# EAGLE design 3340 (EAGLE 7.2.0)
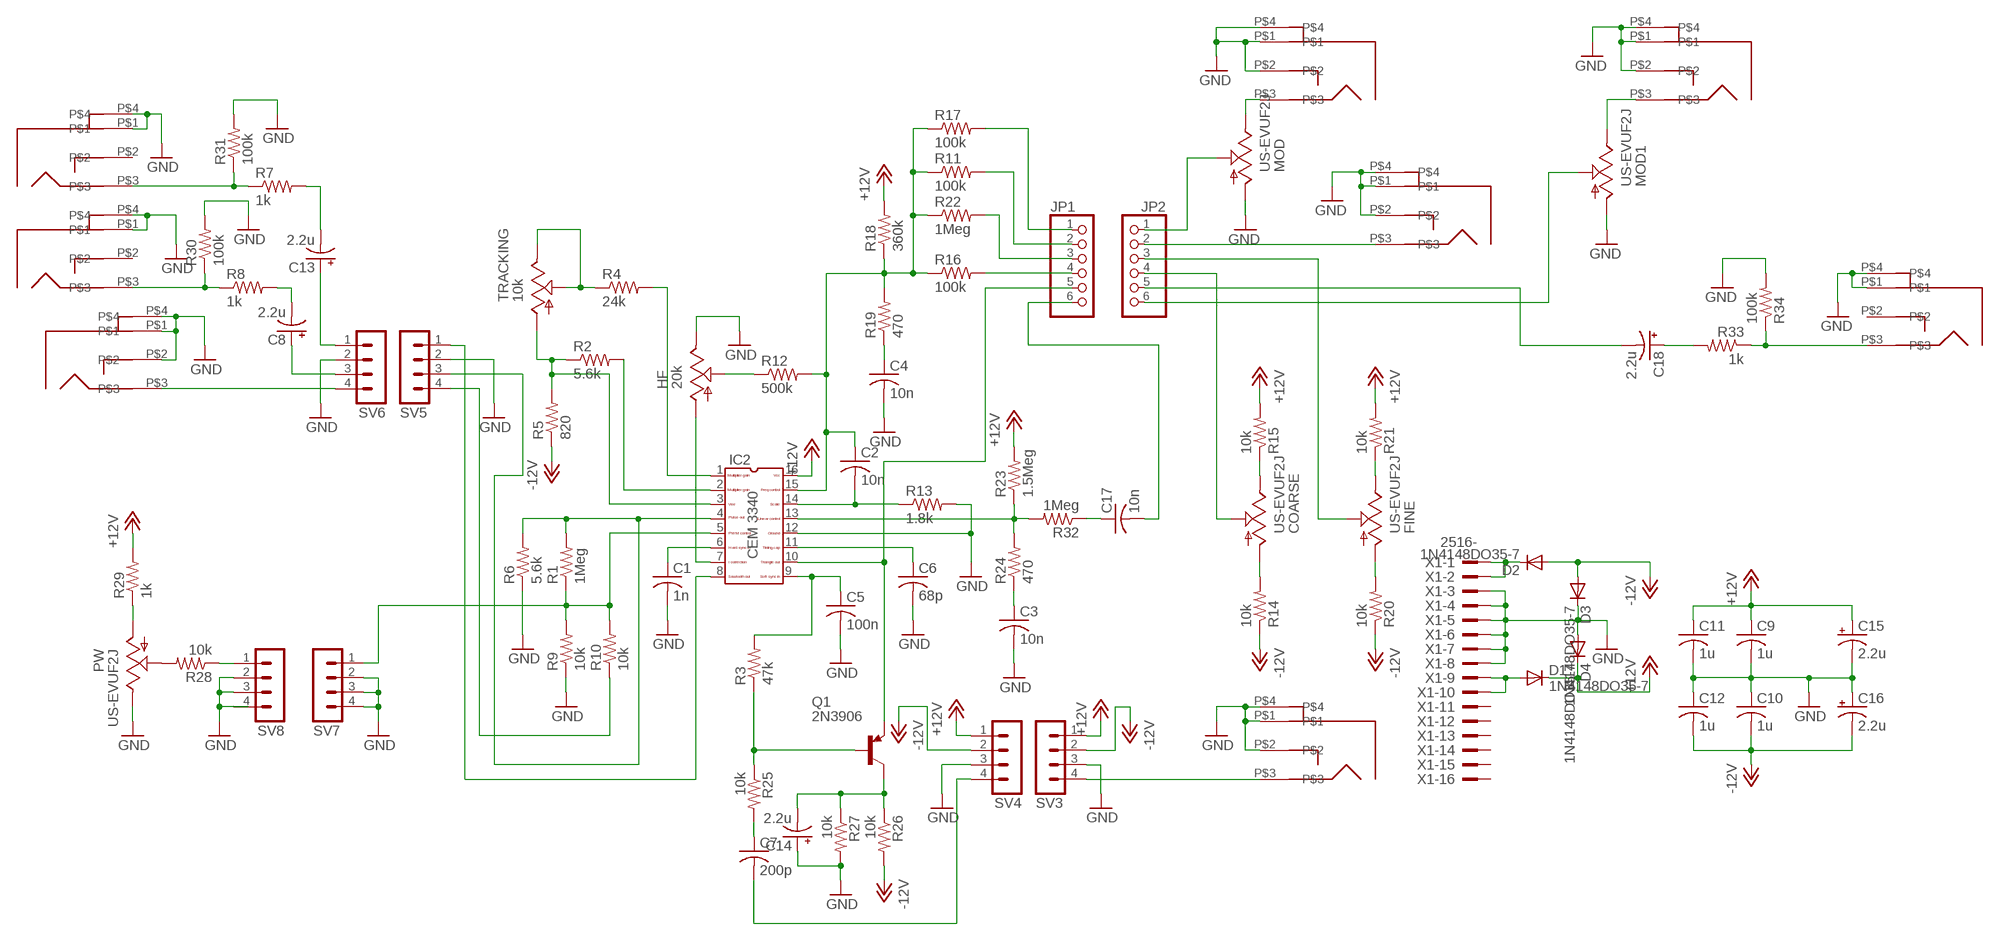
[diagram p0: schematic, sheet 1]

## Parts
C1  1n  C-US050-025X075  [C050-025X075]
C2  10n  C-US050-025X075  [C050-025X075]
C3  10n  C-US050-025X075  [C050-025X075]
C4  10n  C-US050-025X075  [C050-025X075]
C5  100n  C-US050-025X075  [C050-025X075]
C6  68p  C-US050-025X075  [C050-025X075]
C7  200p  C-US050-025X075  [C050-025X075]
C8  2.2u  CPOL-USE2.5-6  [E2,5-6]
C9  1u  C-US050-025X075  [C050-025X075]
C10  1u  C-US050-025X075  [C050-025X075]
C11  1u  C-US050-025X075  [C050-025X075]
C12  1u  C-US050-025X075  [C050-025X075]
C13  2.2u  CPOL-USE2.5-6  [E2,5-6]
C14  2.2u  CPOL-USE2.5-6  [E2,5-6]
C15  2.2u  CPOL-USE2.5-6  [E2,5-6]
C16  2.2u  CPOL-USE2.5-6  [E2,5-6]
C17  10n  C-US050-025X075  [C050-025X075]
C18  2.2u  CPOL-USE2.5-6  [E2,5-6]
COARSE  US-EVUF2J  [EVUFXJ]
CVIN1  PJ301BM  [PJ301BM]
CVIN2  PJ301BM  [PJ301BM]
D1  1N4148DO35-7  [DO35-7]
D2  1N4148DO35-7  [DO35-7]
D3  1N4148DO35-7  [DO35-7]
D4  1N4148DO35-7  [DO35-7]
EXPMOD  PJ301BM  [PJ301BM]
FINE  US-EVUF2J  [EVUFXJ]
HF  20k  TRIM_US-S64W  [S64W]
IC2  CEM3340  [DIL16]
JP1  PINHD-1X6  [1X06]
JP2  PINHD-1X6  [1X06]
MOD  US-EVUF2J  [EVUFXJ]
MOD1  US-EVUF2J  [EVUFXJ]
PULSE  PJ301BM  [PJ301BM]
PW  US-EVUF2J  [EVUFXJ]
PWM  PJ301BM  [PJ301BM]
Q1  2N3906  [TO92]
R1  1Meg  R-US_0207/2V  [0207/2V]
R2  5.6k  R-US_0207/2V  [0207/2V]
R3  47k  R-US_0207/2V  [0207/2V]
R4  24k  R-US_0207/2V  [0207/2V]
R5  820  R-US_0207/2V  [0207/2V]
R6  5.6k  R-US_0207/2V  [0207/2V]
R7  1k  R-US_0207/7  [0207/7]
R8  1k  R-US_0207/7  [0207/7]
R9  10k  R-US_0207/2V  [0207/2V]
R10  10k  R-US_0207/2V  [0207/2V]
R11  100k  R-US_0207/2V  [0207/2V]
R12  500k  R-US_0207/2V  [0207/2V]
R13  1.8k  R-US_0207/2V  [0207/2V]
R14  10k  R-US_0207/7  [0207/7]
R15  10k  R-US_0207/7  [0207/7]
R16  100k  R-US_0207/2V  [0207/2V]
R17  100k  R-US_0207/2V  [0207/2V]
R18  360k  R-US_0207/2V  [0207/2V]
R19  470  R-US_0207/2V  [0207/2V]
R20  10k  R-US_0207/7  [0207/7]
R21  10k  R-US_0207/7  [0207/7]
R22  1Meg  R-US_0207/2V  [0207/2V]
R23  1.5Meg  R-US_0207/2V  [0207/2V]
R24  470  R-US_0207/2V  [0207/2V]
R25  10k  R-US_0207/2V  [0207/2V]
R26  10k  R-US_0207/2V  [0207/2V]
R27  10k  R-US_0207/2V  [0207/2V]
R28  10k  R-US_0207/7  [0207/7]
R29  1k  R-US_0207/7  [0207/7]
R30  100k  R-US_0207/7  [0207/7]
R31  100k  R-US_0207/7  [0207/7]
R32  1Meg  R-US_0207/2V  [0207/2V]
R33  1k  R-US_0207/7  [0207/7]
R34  100k  R-US_0207/7  [0207/7]
SAW  PJ301BM  [PJ301BM]
SAW1  PJ301BM  [PJ301BM]
SV3  MA04-1  [MA04-1]
SV4  MA04-1  [MA04-1]
SV5  MA04-1  [MA04-1]
SV6  MA04-1  [MA04-1]
SV7  MA04-1  [MA04-1]
SV8  MA04-1  [MA04-1]
SYNC  PJ301BM  [PJ301BM]
TRACKING  10k  TRIM_US-S64W  [S64W]
X1  2516-  [PAK100/2500-16]

## Nets
+12V: C9.1 C11.1 C15.+ D1.C D4.C IC2.16 R15.2 R18.2 R21.2 R23.2 R29.2 SV3.1 SV4.1
-12V: C10.2 C12.2 C16.- D2.A D3.A R5.1 R14.1 R20.1 R26.2 SV3.2 SV4.2
GND: C1.2 C3.2 C4.2 C5.2 C6.2 C9.2 C10.1 C11.2 C12.1 C14.+ C15.- C16.+ CVIN1.P$1 CVIN1.P$2 CVIN1.P$4 CVIN2.P$1 CVIN2.P$2 CVIN2.P$4 D3.C D4.A EXPMOD.P$1 EXPMOD.P$2 EXPMOD.P$4 HF.E IC2.12 MOD1.1(A) MOD.1(A) PULSE.P$1 PULSE.P$4 PW.3(E) PWM.P$1 PWM.P$2 PWM.P$4 R6.1 R9.1 R13.2 R27.2 R30.2 R31.2 R34.2 SAW1.P$1 SAW1.P$4 SAW.P$1 SAW.P$4 SV3.3 SV4.3 SV5.2 SV6.2 SV7.2 SV7.3 SV7.4 SV8.2 SV8.3 SYNC.P$1 SYNC.P$2 SYNC.P$4 X1.3 X1.4 X1.5 X1.6 X1.7 X1.8
N$1: IC2.1 R4.2
N$2: IC2.2 R2.2
N$3: R4.1 TRACKING.E TRACKING.S
N$4: IC2.5 R1.1 R9.2 R10.2 SV7.1
N$5: COARSE.2(S) JP2.4
N$6: COARSE.1(A) R14.2
N$7: COARSE.3(E) R15.1
N$8: IC2.4 R1.2 R6.2 SV5.3
N$9: R10.1 SV5.4
N$10: PWM.P$3 SV6.4
N$11: C1.1 IC2.6
N$12: IC2.8 SV5.1
N$13: C13.- R7.2
N$14: R7.1 R31.1 SAW.P$3
N$15: PULSE.P$3 R8.1 R30.1
N$16: HF.A IC2.7
N$17: JP1.4 R16.2
N$18: HF.S R12.1
N$19: C2.1 IC2.15 R11.1 R12.2 R16.1 R17.1 R18.1 R19.2 R22.1
N$20: C5.1 IC2.9 R3.2
N$21: JP1.1 R17.2
N$22: EXPMOD.P$3 MOD.3(E)
N$23: C6.1 IC2.11
N$24: C17.1 R32.1
N$25: JP1.2 R11.2
N$26: C13.+ SV6.1
N$27: C8.+ SV6.3
N$28: PW.2(S) R28.2
N$29: C2.2 IC2.14 R13.1
N$30: SV3.4 SYNC.P$3
N$31: JP2.1 MOD.2(S)
N$32: IC2.10 JP1.5 Q1.3(E)
N$33: FINE.1(A) R20.2
N$34: C4.1 R19.1
N$35: CVIN1.P$3 JP2.2
N$36: FINE.3(E) R21.1
N$37: FINE.2(S) JP2.3
N$38: IC2.13 R23.1 R24.2 R32.2
N$39: JP1.3 R22.2
N$40: C3.1 R24.1
N$41: Q1.2(B) R3.1 R25.1
N$42: C7.1 R25.2
N$43: D2.C X1.1 X1.2
N$44: C7.2 SV4.4
N$45: D1.A X1.9 X1.10
N$46: C14.- Q1.1(C) R26.1 R27.1
N$47: PW.1(A) R29.1
N$48: R28.1 SV8.1
N$49: C8.- R8.2
N$50: IC2.3 R2.1 R5.2 TRACKING.A
N$51: C17.2 JP1.6
N$52: JP2.6 MOD1.2(S)
N$53: C18.+ R33.2
N$54: R33.1 R34.1 SAW1.P$3
N$55: C18.- JP2.5
N$56: CVIN2.P$3 MOD1.3(E)
Unconnected: PULSE.P$2 SAW1.P$2 SAW.P$2 SV8.4 X1.11 X1.12 X1.13 X1.14 X1.15 X1.16

## Library data of the parts
C1-C7 C9-C12 C17 = dan:C-US: CAPACITOR, American symbol
C8 C13-C16 C18 = dan:CPOL-US: POLARIZED CAPACITOR, American symbol
COARSE FINE MOD MOD1 PW = dan:US-EVU: 9 mm Square Rotary Potentiometers Source: Panasonic
CVIN1 CVIN2 EXPMOD PULSE PWM SAW SAW1 SYNC = dan:PJ301BM
D1-D4 = dan:1N4148: DIODE high speed (Philips)
HF TRACKING = dan:TRIM_US-: POTENTIOMETER
IC2 = CEM:CEM3340: CEM 3340 VCO
JP1 JP2 = dan:PINHD-1X6: PIN HEADER
Q1 = dan:2N3906: PNP Transistor
R1-R34 = dan:R-US_: RESISTOR, American symbol
SV3-SV8 = dan:MA04-1: PIN HEADER; OC_FARNELL: unknown; OC_NEWARK: unknown
X1 = dan:2516-: 3M (TM) Pak 100 4-Wall Header Source: 3M; OC_FARNELL: unknown; OC_NEWARK: unknown

## Board
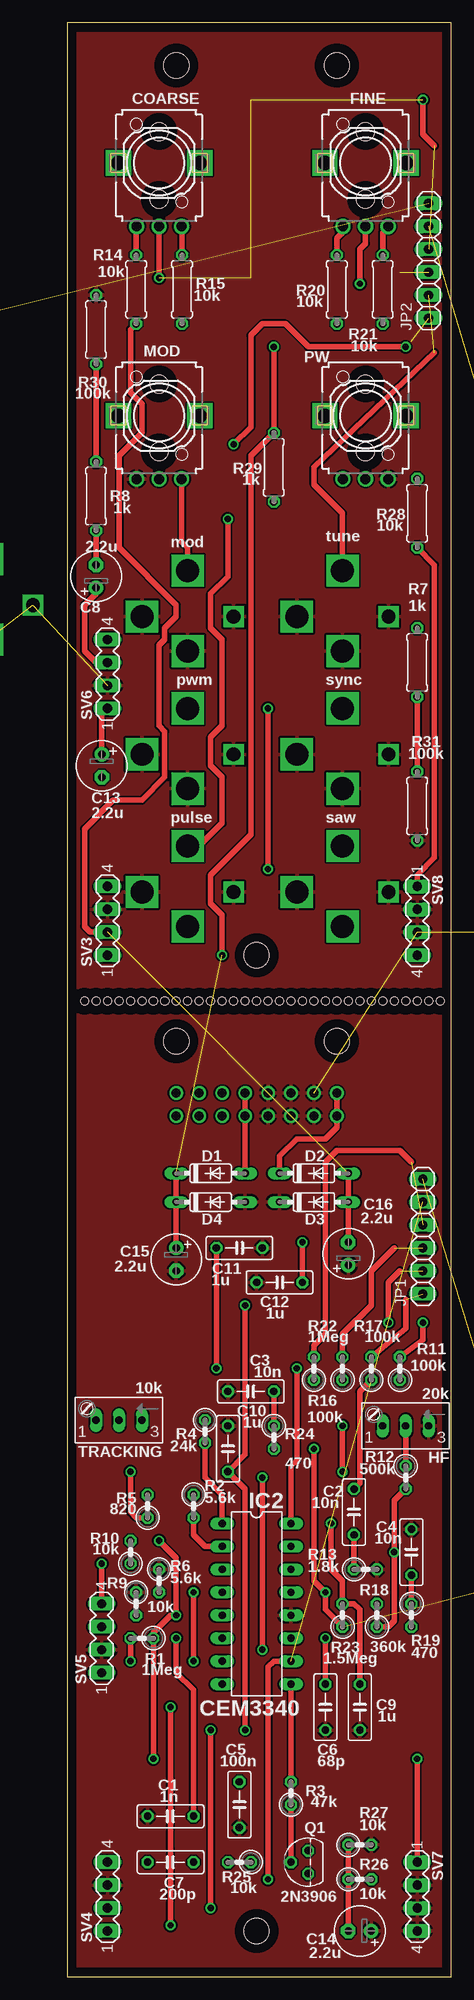
[diagram p1: board, top side]
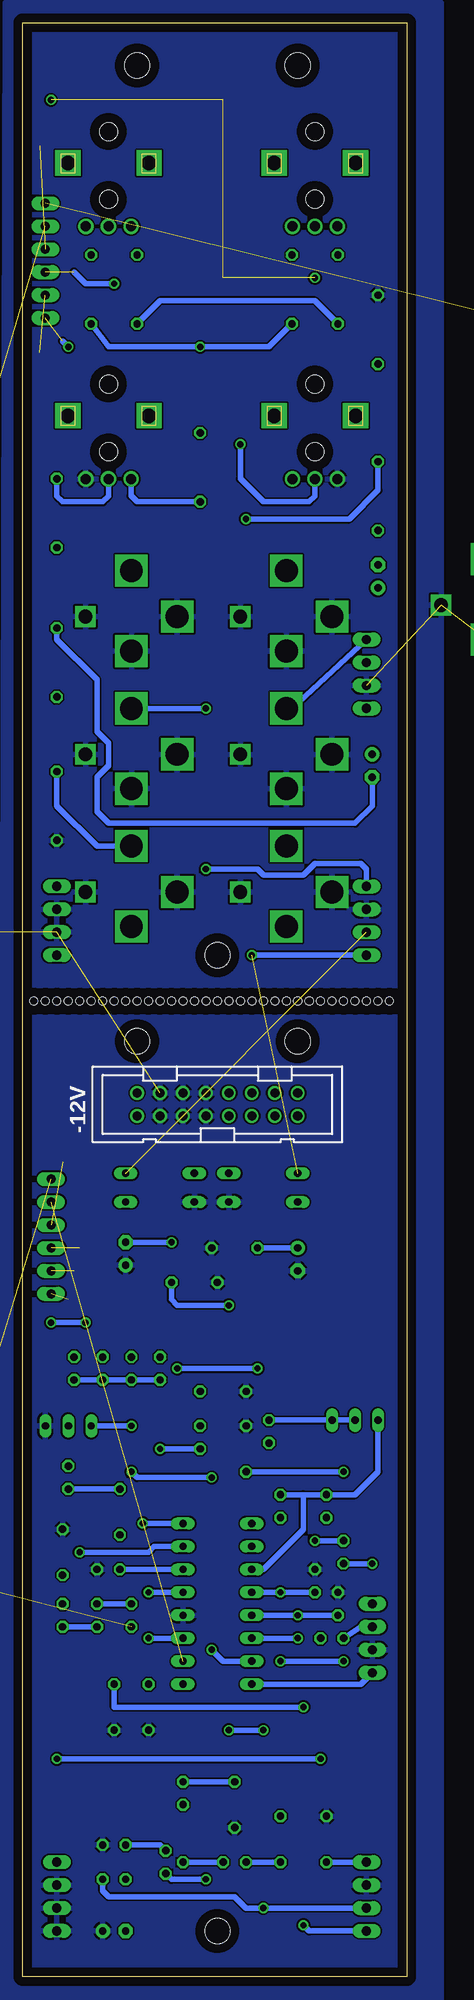
[diagram p2: board, bottom side, seen from below]

Size 42.52 x 216.21 mm. Coordinates in mm from the lower left corner, seen from the top.
Outline: 0,0 42.52,0 42.52,216.21 0,216.21 0,0
Copper layers (1*16): Top 0.035mm / dielectric 1.5mm / Bottom 0.035mm
Design rules "default": minimum track width 10mil, minimum drill 24mil, track to track 8mil, track to pad 8mil, pad to pad 8mil, via to via 8mil, smd to smd 8mil, copper to edge 40mil, drill to drill 8mil, minimum pad ring 10mil, minimum via ring 8mil, stop-mask expansion 4mil, vias tented up to drill 0mil, thermal gap 10mil
Holes 0.9 mm at 10.79,107.95 9.53,107.95 8.26,107.95 6.99,107.95 5.71,107.95 4.45,107.95 3.17,107.95 1.91,107.95 12.06,107.95 13.34,107.95 14.61,107.95 15.88,107.95 26.04,107.95 24.77,107.95 23.5,107.95 22.23,107.95 20.95,107.95 19.68,107.95 18.41,107.95 17.14,107.95 27.3,107.95 28.57,107.95 29.84,107.95 31.11,107.95 41.27,107.95 40.01,107.95 38.73,107.95 37.47,107.95 36.2,107.95 34.92,107.95 33.66,107.95 32.38,107.95
Holes 2.8 mm at 12.06,211.46 29.84,211.46 12.06,103.5 29.84,103.5 20.95,5.08 20.95,113.03

### Footprints (pad centres in the part's own frame; a part is rotated, then mirrored left to right if it is on the bottom)
C050-025X075 = drill 0.813 octagon: 1 -2.54,0; 2 2.54,0
E2,5-6 = drill 0.813 pad 1.6: + -1.27,0 | drill 0.813 pad 1.6 octagon: - 1.27,0
EVUFXJ = drill 1.1 pad 1.676: 1 -2.5,-7; 2 0,-7; 3 2.5,-7 | drill 1.6 pad 2.8 square: M1 4.5,0; M2 -4.5,0 | hole 2: 0,3.5; 0,-4
PJ301BM = drill 1.524 square: P$1 5.08,0 | drill 2.54 square: P$2 0,-3.81; P$3 0,5.08; P$4 -5.08,0
DO35-7 = drill 0.813 long: A 3.81,0; C -3.81,0
S64W = drill 0.813 long: A 2.54,1.27; E -2.54,1.27; S 0,1.27
DIL16 = drill 0.813 long: 1 -8.89,-3.81; 2 -6.35,-3.81; 3 -3.81,-3.81; 4 -1.27,-3.81; 5 1.27,-3.81; 6 3.81,-3.81; 7 6.35,-3.81; 8 8.89,-3.81; 9 8.89,3.81; 10 6.35,3.81; 11 3.81,3.81; 12 1.27,3.81; 13 -1.27,3.81; 14 -3.81,3.81; 15 -6.35,3.81; 16 -8.89,3.81
1X06 = drill 1.016 long: 1 -6.35,0; 2 -3.81,0; 3 -1.27,0; 4 1.27,0; 5 3.81,0; 6 6.35,0
TO92 = drill 0.813 octagon: 1 1.27,0; 2 0,1.905; 3 -1.27,0
0207/2V = drill 0.813 octagon: 1 -1.27,0; 2 1.27,0
0207/7 = drill 0.813 octagon: 1 -3.81,0; 2 3.81,0
MA04-1 = drill 1.016 long: 1 -3.81,0; 2 -1.27,0; 3 1.27,0; 4 3.81,0
PAK100/2500-16 = drill 1 pad 1.422: 1 -8.89,-1.27; 2 -8.89,1.27; 3 -6.35,-1.27; 4 -6.35,1.27; 5 -3.81,-1.27; 6 -3.81,1.27; 7 -1.27,-1.27; 8 -1.27,1.27; 9 1.27,-1.27; 10 1.27,1.27; 11 3.81,-1.27; 12 3.81,1.27; 13 6.35,-1.27; 14 6.35,1.27; 15 8.89,-1.27; 16 8.89,1.27

### Placement (x,y rotation side)
C1  11.43,17.78 180 top
C2  31.75,51.44 270 top
C3  20.32,64.77 180 top
C4  38.1,46.99 90 top
C5  19.05,19.05 270 top
C6  28.57,29.84 270 top
C7  11.43,12.7 180 top
C8  3.17,154.94 90 top
C9  32.38,29.84 270 top
C10  17.78,58.42 270 top
C11  19.05,80.64 0 top
C12  23.5,76.83 0 top
C13  3.81,133.99 270 top
C14  32.38,5.08 180 top
C15  12.06,79.38 270 top
C16  31.11,80.01 90 top
C17  48.9,48.9 0 top  (outside the outline)
C18  60.96,119.38 0 top  (outside the outline)
COARSE  10.16,200.66 0 top
CVIN1  30.48,150.5 0 top
CVIN2  -8.89,151.76 0 top  (outside the outline)
D1  15.88,88.9 0 top
D2  27.3,88.9 0 top
D3  27.3,85.72 0 top
D4  15.88,85.72 0 top
EXPMOD  13.34,150.5 0 top
FINE  33.02,200.66 0 top
HF  37.47,62.23 180 top
IC2  20.95,41.27 270 top
JP1  39.37,81.92 90 top
JP2  40.01,189.87 90 top
MOD  10.16,172.72 0 top
MOD1  -19.05,188.59 0 top  (outside the outline)
PULSE  13.34,120.02 0 top
PW  33.02,172.72 0 top
PWM  13.34,135.25 0 top
Q1  26.67,12.7 90 top
R1  8.26,37.47 180 top
R2  13.97,52.07 270 top
R3  24.77,20.32 90 top
R4  15.24,60.33 270 top
R5  8.89,52.07 90 top
R6  10.16,43.81 270 top
R7  38.73,145.41 90 top
R8  3.17,163.83 270 top
R9  7.62,41.27 270 top
R10  6.99,46.99 90 top
R11  36.83,67.31 90 top
R12  37.47,55.24 270 top
R13  33.02,45.09 0 top
R14  7.62,186.69 90 top
R15  12.7,186.69 270 top
R16  27.3,67.31 90 top
R17  33.66,67.31 90 top
R18  34.29,40.01 90 top
R19  38.1,40.01 270 top
R20  29.84,186.69 90 top
R21  34.92,186.69 270 top
R22  30.48,67.31 90 top
R23  30.48,40.01 90 top
R24  22.86,59.69 270 top
R25  19.05,12.7 180 top
R26  32.38,10.79 0 top
R27  32.38,14.61 0 top
R28  38.73,161.93 90 top
R29  22.86,167 90 top
R30  3.17,182.25 90 top
R31  38.73,129.54 270 top
R32  48.9,43.81 0 top  (outside the outline)
R33  52.07,120.02 0 top  (outside the outline)
R34  52.07,115.57 0 top  (outside the outline)
SAW  30.48,120.02 0 top
SAW1  79.38,118.11 0 top  (outside the outline)
SV3  4.45,116.84 90 top
SV4  4.45,8.89 90 top
SV5  3.81,37.47 90 top
SV6  4.45,144.15 90 top
SV7  38.73,8.89 270 top
SV8  38.73,116.84 270 top
SYNC  30.48,135.25 0 top
TRACKING  5.71,62.87 180 top
X1  20.95,96.52 0 bottom

### Tracks (layer width: path | path; a pad name or v marks a point on that pad's centre or on a via)
+12V  (via drill 0.7)  (1 unrouted)
  Top 0.61: D1.C D4.C C15.+ | C9.1 32.38,40.64 31.75,41.27 R23.2 30.48,43.81 29.21,45.09 v29.21,50.16 | v11.43,5.71 v11.43,29.84 | IC2.16 24.77,56.52 25.4,57.15 v25.4,67.31 | v16.51,67.31 C11.1 | v22.86,180.34 R29.2 20.32,168.28 20.32,126.36 15.88,121.92 15.88,118.75 17.14,117.47 v17.14,113.03
  Bottom 0.61: R18.2 R23.2 | SV4.1 10.79,5.08 v11.43,5.71 | v11.43,29.84 32.38,29.84 C9.1 | v29.21,50.16 IC2.16 | v25.4,67.31 v16.51,67.31 | C11.1 C15.+ | R15.2 15.24,180.34 v22.86,180.34 33.02,180.34 R21.2 | SV3.1 v17.14,113.03
-12V  (via drill 0.7)  (1 unrouted)
  Top 0.61: D2.A D3.A C16.- | v19.68,27.3 19.68,53.98 C10.2 19.68,57.78 v19.68,74.3 | v15.88,27.3 v15.88,7.62 | R5.1 7.62,50.8 6.99,51.44 v6.99,55.88 | C12.2 v26.04,81.28 | SV3.2 2.54,115.57 1.91,116.2 1.91,127 5.08,130.18 8.26,130.18 10.79,132.72 10.79,137.79 10.16,138.43 10.16,147.32 10.79,147.96 10.79,149.22 12.06,150.5 12.06,151.76 5.71,158.12 5.71,168.28 8.26,170.81 8.26,173.99 6.99,175.26 6.99,182.25 R14.1
  Bottom 0.61: SV4.2 v15.88,7.62 17.78,7.62 19.05,8.89 33.02,8.89 33.66,9.53 R26.2 | v19.68,27.3 v15.88,27.3 | v6.99,55.88 C10.2 | v19.68,74.3 25.4,74.3 26.04,74.93 C12.2 | v26.04,81.28 C16.- | R14.1 10.16,185.42 27.3,185.42 R20.1
GND  (8 unrouted)
  pour Top: -1.27,218.44 44.45,218.44 44.45,-2.54 -1.91,-2.54 -1.91,217.81
  pour Bottom: -3.81,218.44 44.45,218.44 45.09,-3.17 -3.81,-3.17
N$1
  Top 0.61: IC2.1 17.14,53.34 15.24,55.24 R4.2
N$2
  Top 0.61: R2.2 13.97,48.9 15.24,47.62 IC2.2
N$3
  Bottom 0.61: R4.1 TRACKING.E TRACKING.S
N$4  (via drill 0.7)
  Top 0.61: v10.16,48.26 12.06,46.35 v12.06,40.01 11.43,40.01 9.53,38.1 R1.1 v9.53,24.13 | SV7.1 v38.73,24.13
  Bottom 0.61: R9.2 v12.06,40.01 IC2.5 | R10.2 v10.16,48.26 | v38.73,24.13 v9.53,24.13
N$5  (via drill 0.7)  (6 unrouted)
  Top 0.61: v10.16,187.96 COARSE.2 | v39.37,207.65 39.37,203.84 40.64,202.56
N$6
  Top 0.61: R14.2 7.62,193.62 COARSE.1
N$7
  Top 0.61: R15.1 12.7,193.62 COARSE.3
N$8  (via drill 0.7)
  Top 0.61: R1.2 v6.99,34.92 | v13.97,34.92 v13.97,42.55
  Bottom 0.61: R6.2 v13.97,42.55 IC2.4 | R1.2 5.08,38.73 SV5.3 | v6.99,34.92 v13.97,34.92
N$9  (via drill 0.7)
  Top 0.61: SV5.4 v3.81,45.72
  Bottom 0.61: v3.81,45.72 R10.1
N$10
  Bottom 0.61: SV6.4 12.7,140.34 PWM.P$3
N$11  (via drill 0.7)
  Top 0.61: C1.1 13.97,31.75 12.06,33.66 v12.06,37.47
  Bottom 0.61: IC2.6 v12.06,37.47
N$12
  Bottom 0.61: IC2.8 5.08,32.38 SV5.1
N$13
  Bottom 0.61: C13.- 3.81,129.54 5.71,127.64 33.02,127.64 34.29,128.91 34.29,132.72 33.02,133.99 33.02,136.53 34.29,137.79 34.29,143.51 38.73,147.96 R7.2
N$14
  Top 0.61: R7.1 R31.1
  Bottom 0.61: SAW.P$3 34.29,125.09 38.73,129.54 R31.1
N$15  (via drill 0.7)
  Top 0.61: R30.1 R8.1 | PULSE.P$3 14.61,125.09 17.14,127.64 17.14,132.72 15.88,133.99 15.88,137.16 17.14,138.43 17.14,147.96 15.88,149.22 15.88,153.03 17.78,154.94 v17.78,161.29
  Bottom 0.61: v17.78,161.29 6.35,161.29 3.17,164.47 R8.1
N$16  (via drill 0.7)
  Top 0.61: v21.59,36.2 v21.59,55.24 | v30.48,55.88 v30.48,60.96
  Bottom 0.61: IC2.7 20.32,34.92 v21.59,36.2 | v21.59,55.24 29.84,55.24 v30.48,55.88 | v30.48,60.96 HF.A
N$17  (1 unrouted)
  Top 0.61: R16.2 27.3,69.85 28.57,71.12 28.57,90.17 29.84,91.44 36.83,91.44 38.1,90.17
N$18
  Top 0.61: HF.S R12.1
N$19  (via drill 0.7)
  Top 0.61: R18.1 35.56,38.73 36.2,39.37 v36.2,46.99 36.2,52.7 R12.2 | C2.1 32.38,54.61 32.38,64.77 R17.1
  Bottom 0.61: R19.2 R18.1 | C2.1 R12.2 | IC2.15 27.94,47.62 28.57,46.99 v36.2,46.99 | R11.1 R17.1 R22.1 R16.1
N$20
  Top 0.61: IC2.9 R3.2
  Bottom 0.61: R3.2 C5.1
N$21  (1 unrouted)
  Top 0.61: R17.2 37.47,71.75 37.47,74.93
N$22
  Top 0.61: MOD.3 12.66,158.71 13.34,158.12 EXPMOD.P$3
N$23  (via drill 0.7)
  Top 0.61: C6.1 v28.57,37.47
  Bottom 0.61: v28.57,37.47 IC2.11
N$24  (1 unrouted)
N$25  (via drill 0.7)  (1 unrouted)
  Top 0.61: R11.2 39.37,70.48 v39.37,72.39 | v35.56,72.39 35.56,76.83 36.83,78.11
  Bottom 0.61: v39.37,72.39 v35.56,72.39
N$26
  Top 0.61: C13.+ 3.81,139.7 SV6.1
N$27
  Top 0.61: SV6.3 3.17,145.41 1.91,146.69 1.91,151.76 3.17,153.03 C8.+
N$28
  Bottom 0.61: R28.2 38.73,163.83 38.1,163.19 33.66,163.19 33.02,163.83 PW.2
N$29
  Top 0.61: R13.1 C2.2
  Bottom 0.61: R13.1 IC2.14
N$30  (via drill 0.7)
  Top 0.61: v22.23,140.34 v22.23,122.56
  Bottom 0.61: SYNC.P$3 v22.23,140.34 | v22.23,122.56 16.51,122.56 15.88,121.92 11.43,121.92 10.16,123.19 5.08,123.19 4.45,122.56 SV3.4
N$31  (via drill 0.7)  (1 unrouted)
  Top 0.61: v37.47,180.34 26.67,180.34 24.13,182.88 21.59,182.88 20.32,181.61 20.32,171.45 v18.41,169.54
  Bottom 0.61: v18.41,169.54 18.41,165.74 15.88,163.19 10.79,163.19 10.16,163.83 MOD.2 | 38.1,180.97 v37.47,180.34
N$32  (via drill 0.7)  (1 unrouted)
  Top 0.61: IC2.10 22.86,34.92 22.23,34.29 v22.23,10.79
  Bottom 0.61: v22.23,10.79 26.04,10.79 Q1.3
N$33
  Top 0.61: FINE.1 30.48,192.99 29.84,192.35 R20.2
N$34
  Top 0.61: R19.1 C4.1
N$35  (1 unrouted)
  Top 0.61: CVIN1.P$3 30.48,161.93 27.3,165.1 27.3,167 40.64,179.71
N$36
  Top 0.61: R21.1 34.92,192.99 FINE.3
N$37  (via drill 0.7)  (1 unrouted)
  Top 0.61: v32.38,187.32 32.38,191.13 33.02,191.77 FINE.2
  Bottom 0.61: 36.83,188.59 35.56,187.32 v32.38,187.32
N$38  (via drill 0.7)  (1 unrouted)
  Top 0.61: R23.1 28.57,40.64 v28.57,42.55 27.3,43.81 v27.3,58.42
  Bottom 0.61: IC2.13 v28.57,42.55 | R24.2 v27.3,58.42
N$39  (1 unrouted)
  Top 0.61: R22.2 30.48,71.12 33.66,74.3 33.66,78.11 36.2,80.64
N$40
  Top 0.61: R24.1 C3.1
N$41
  Top 0.61: R3.1 Q1.2
  Bottom 0.61: R25.1 Q1.2
N$42
  Bottom 0.61: C7.1 R25.2
N$43
  Top 0.61: X1.2 X1.1 29.84,93.98 28.57,92.71 25.4,92.71 23.5,90.81 D2.C
N$44
  Bottom 0.61: SV4.4 C7.2
N$45
  Top 0.61: X1.10 X1.9 D1.A
N$46
  Top 0.61: R27.1 R26.1 C14.-
  Bottom 0.61: R27.1 27.3,14.61 Q1.1
N$47
  Bottom 0.61: PW.1 30.52,163.87 29.84,163.19 R29.1
N$48
  Top 0.61: SV8.1 38.73,121.92 40.64,123.83 40.64,156.21 R28.1
N$49
  Top 0.61: C8.- R8.2
N$50
  Bottom 0.61: IC2.3 15.88,45.09 11.43,49.53 11.43,53.34 | 11.43,53.34 R5.2 5.71,53.34 3.17,55.88 TRACKING.A | R2.1 11.43,53.34
N$51  (1 unrouted)
N$52  (1 unrouted)
N$53  (1 unrouted)
N$54  (2 unrouted)
N$55  (1 unrouted)
N$56  (1 unrouted)

### Text on the board
tPlace: tune | mod | pwm | sync | pulse | saw
bPlace: -12V